# EasyEDA Pro project MatrixClock.eprj

# Schematic Schematic1
Board Name: 主控板; Create Date: 2025-03-18; Page Name: P1; Project Name: MatrixClock; Schematic Name: Schematic1; Update Date: 2025-03-29; Company: 小飞科技; Drawed: 程序匠小飞; Page Size: A4; Version: V1.0
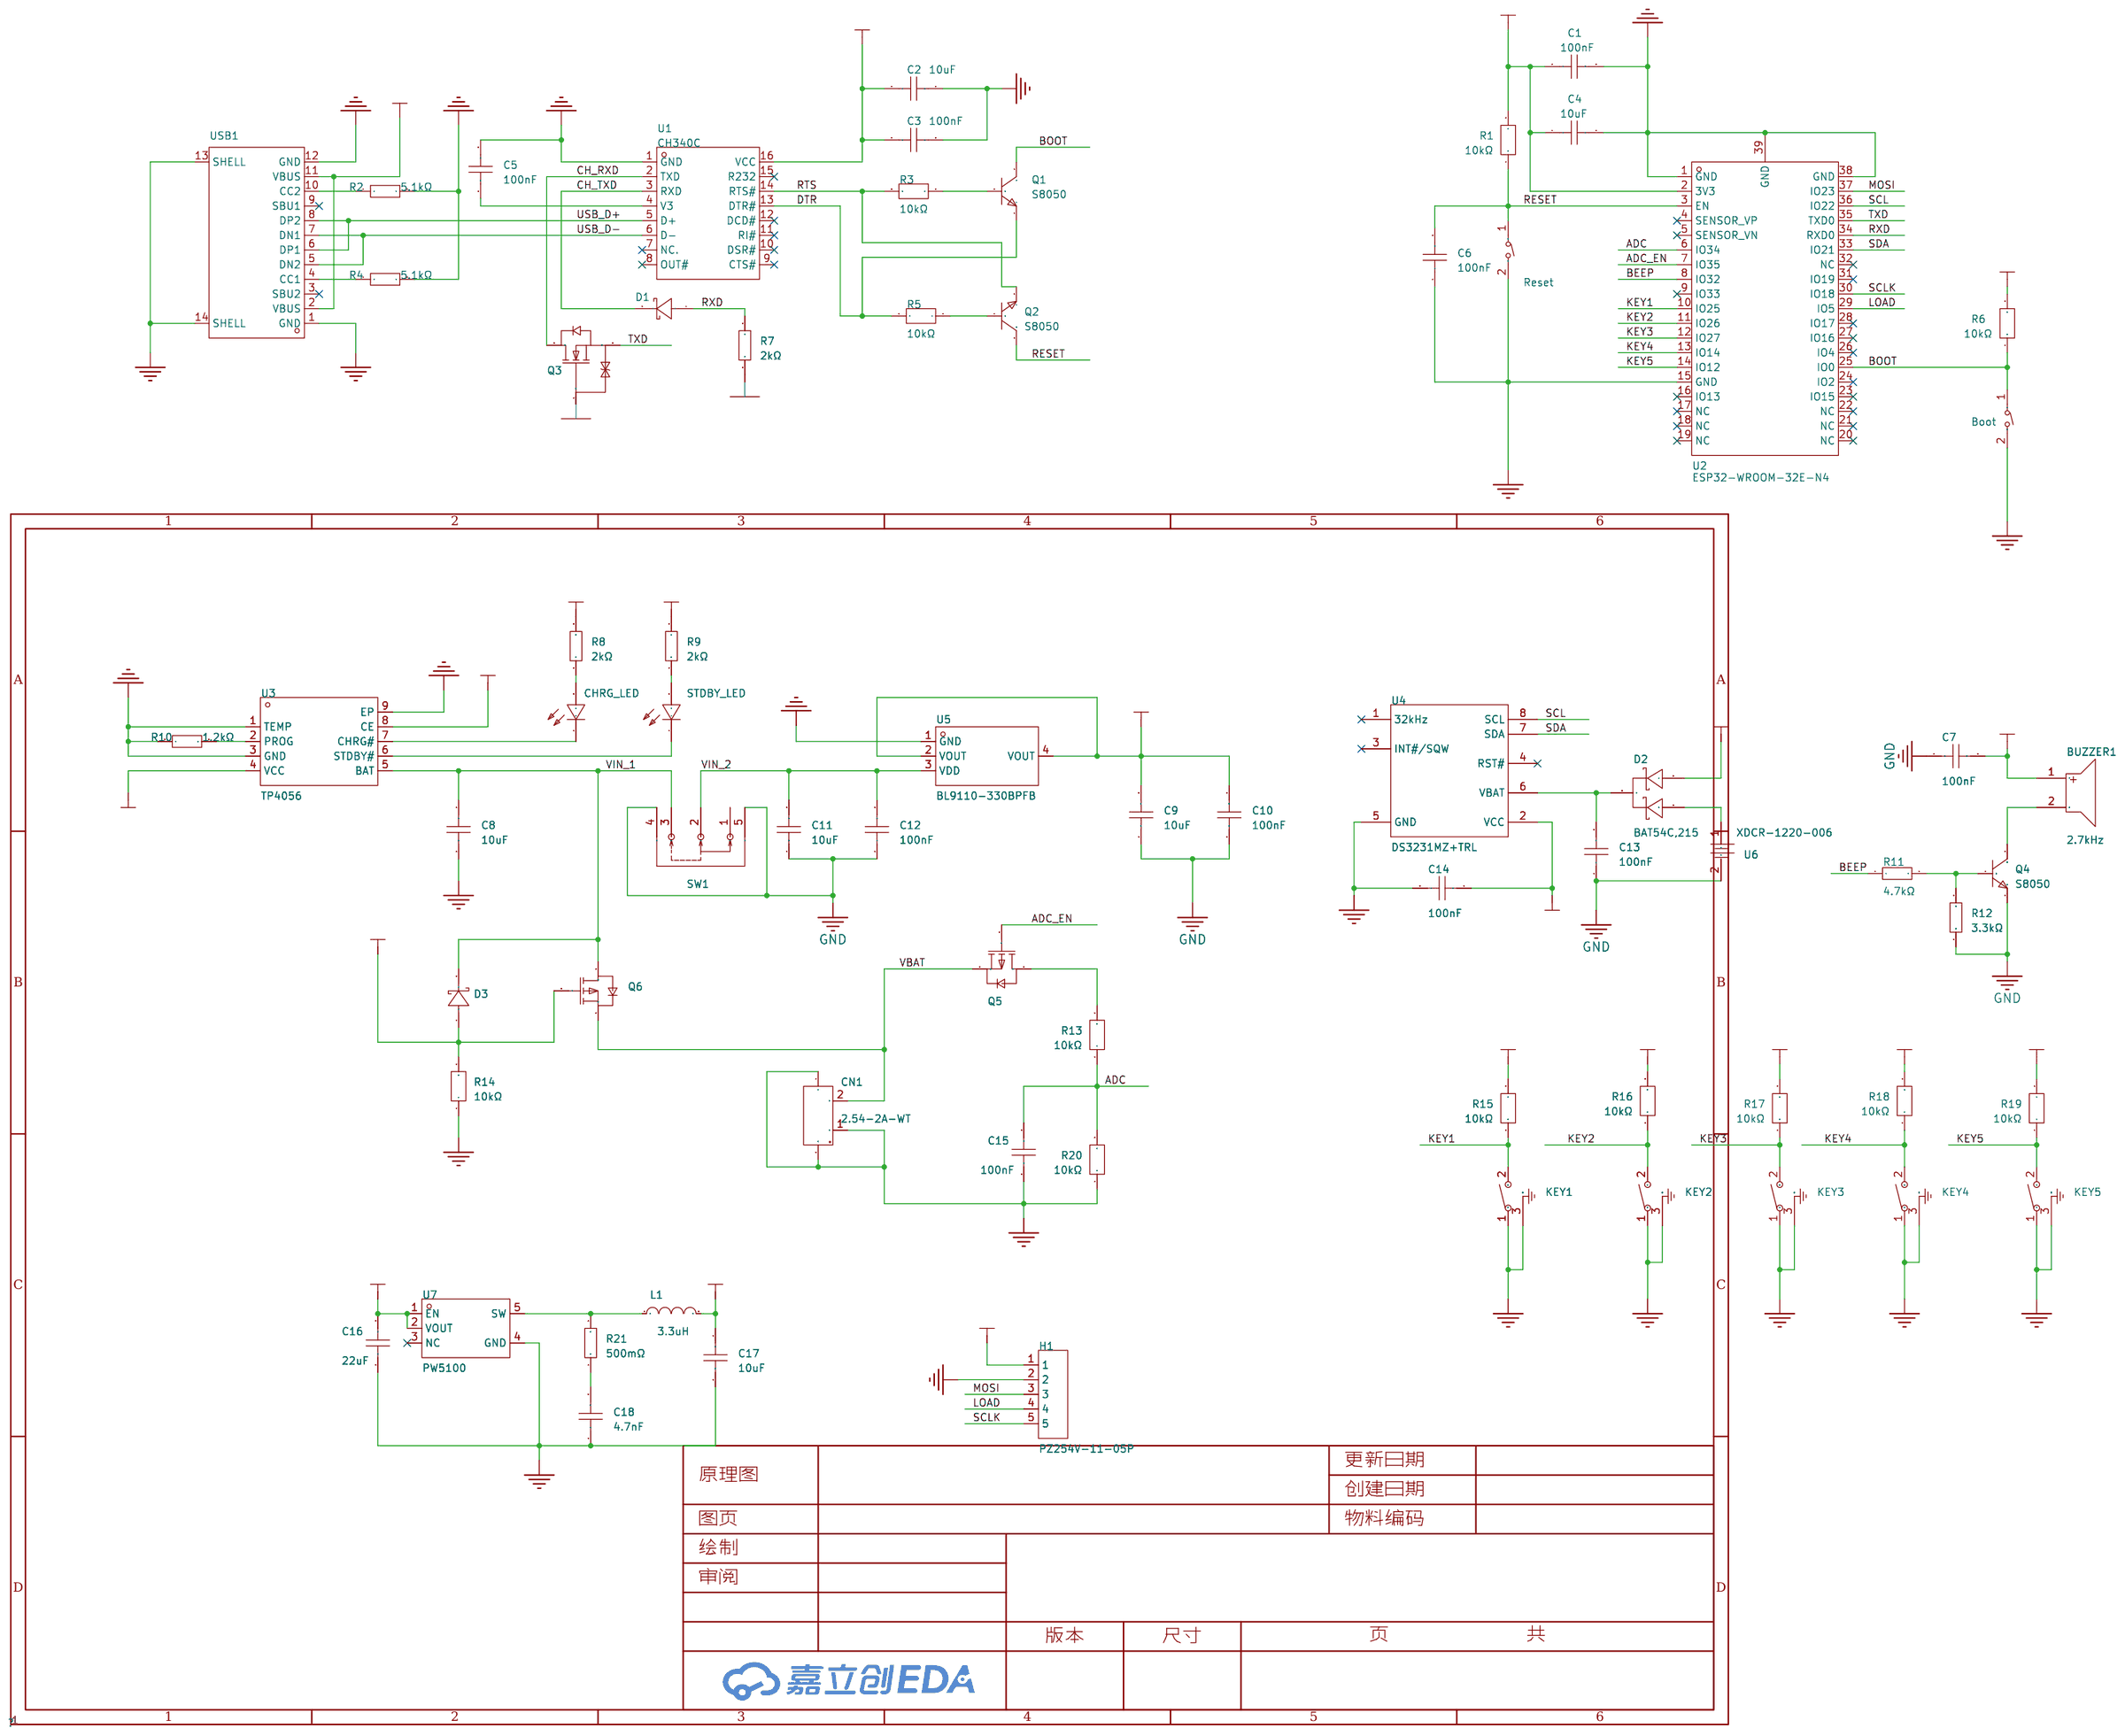
[diagram p0: schematic sheet]

## Parts
Boot  ZX-QC34-2TPDZ  [KEY-SMD_L3.9-W3.0-LS5.0-EH]
BUZZER1  2.7kHz  [BUZ-TH_BD9.0-P4.00-D0.6-FD]
C1  100nF  [C0603]
C2  10uF  [C0603]
C3  100nF  [C0603]
C4  10uF  [C0603]
C5  100nF  [C0603]
C6  100nF  [C0603]
C7  100nF  [C0603]
C8  10uF  [C0603]
C9  10uF  [C0603]
C10  100nF  [C0603]
C11  10uF  [C0603]
C12  100nF  [C0603]
C13  100nF  [C0603]
C14  100nF  [C0603]
C15  100nF  [C0603]
C16  22uF  [C0603]
C17  10uF  [C0603]
C18  4.7nF  [C0603]
CHRG_LED  NCD0603R1  [LED0603-RD_RED]
CN1  2.54-2A-WT  [CONN-SMD_2.54-2A-WT]
D1  B5819WS  [SOD-323_L1.7-W1.3-LS2.5-FD]
D2  BAT54C,215  [SOT-23-3_L2.9-W1.6-P1.90-LS2.8-BR]
D3  B5819WS  [SOD-323_L1.7-W1.3-LS2.5-FD]
H1  PZ254V-11-05P  [HDR-TH_5P-P2.54-V-M]
KEY1  TS-1045-A13B3-D2  [SW-SMD_L7.5-W8.0-P4.50_TS-1045-A13B3-D2]
KEY2  TS-1045-A13B3-D2  [SW-SMD_L7.5-W8.0-P4.50_TS-1045-A13B3-D2]
KEY3  TS-1045-A13B3-D2  [SW-SMD_L7.5-W8.0-P4.50_TS-1045-A13B3-D2]
KEY4  TS-1045-A13B3-D2  [SW-SMD_L7.5-W8.0-P4.50_TS-1045-A13B3-D2]
KEY5  TS-1045-A13B3-D2  [SW-SMD_L7.5-W8.0-P4.50_TS-1045-A13B3-D2]
L1  3.3uH  [IND-SMD_L4.4-W4.2-A]
Q1  S8050  [SOT-23-3_L2.9-W1.3-P1.90-LS2.3-BR]
Q2  S8050  [SOT-23-3_L2.9-W1.3-P1.90-LS2.3-BR]
Q3  2SK3018  [SOT-23-3_L2.9-W1.3-P1.90-LS2.4-BR]
Q4  S8050  [SOT-23-3_L2.9-W1.3-P1.90-LS2.3-BR]
Q5  SI2301CDS-T1-GE3-ES  [SOT-23-3_L2.9-W1.3-P1.90-LS2.4-BR]
Q6  SI2301CDS-T1-GE3-ES  [SOT-23-3_L2.9-W1.3-P1.90-LS2.4-BR]
R1  10kΩ  [R0603]
R2  5.1kΩ  [R0603]
R3  10kΩ  [R0603]
R4  5.1kΩ  [R0603]
R5  10kΩ  [R0603]
R6  10kΩ  [R0603]
R7  2kΩ  [R0603]
R8  2kΩ  [R0603]
R9  2kΩ  [R0603]
R10  1.2kΩ  [R0603]
R11  4.7kΩ  [R0603]
R12  3.3kΩ  [R0603]
R13  10kΩ  [R0603]
R14  10kΩ  [R0603]
R15  10kΩ  [R0603]
R16  10kΩ  [R0603]
R17  10kΩ  [R0603]
R18  10kΩ  [R0603]
R19  10kΩ  [R0603]
R20  10kΩ  [R0603]
R21  500mΩ  [R0603]
Reset  ZX-QC34-2TPDZ  [KEY-SMD_L3.9-W3.0-LS5.0-EH]
STDBY_LED  NCD0603C1  [LED0603-RD]
SW1  SK12D07VG4  [SW-TH_SK12D07VG4]
U1  CH340C  [SOP-16_L10.0-W3.9-P1.27-LS6.0-BL]
U2  ESP32-WROOM-32E-N4  [WIFI-SMD_ESP32-WROOM-32E]
U3  TP4056  [ESOP-8_L4.9-W3.9-P1.27-LS6.0-BL-EP]
U4  DS3231MZ+TRL  [SOIC-8_L4.9-W3.9-P1.27-LS6.0-BL]
U5  BL9110-330BPFB  [SOT-223_L6.5-W3.5-P2.30-LS7.0-BR]
U6  XDCR-1220-006  [BAT-SMD_CR1220-2ZX]
U7  PW5100  [SOT-23-5_L2.9-W1.6-P0.95-LS2.8-BL]
USB1  TYPE-C 16PIN 2MD(073)  [USB-C-SMD_TYPE-C-6PIN-2MD-073]

## Library data of the parts
Boot Reset = ZX-QC34-2TPDZ: 电路结构:单刀单掷;按钮形状:圆形按钮;作用力:2.6N;安装方式:立贴;开关长度:3mm;开关宽度:4mm;开关高度:2mm;带支架:不带;触点电流:50mA;额定电压(AC):250V;额定电压(DC):12V;绝缘电阻:100MΩ;机械寿命:10万次;; LCSC Part Name: 3*4*2贴片开关带柱; Supplier Part: C7470219; Manufacturer: Megastar(兆星); Supplier Footprint: SMD; JLCPCB Part Class: Extended Part; Datasheet: https://atta.szlcsc.com/upload/public/pdf/source/20230724/D2731FAADF93973E25928DE23F241F8A.pdf; Supplier: LCSC; Circuit: 单刀单掷; Actuator Style: 圆形按钮; Operating Force: 2.6N; Mounting Style: 立贴; Switch Length: 3mm; Switch Width: 4mm; Switch Height: 2mm; Strike Gundam: 不带; Contact Current: 50mA; Voltage Rating (AC): 250V; Voltage Rating (DC): 12V; Insulation Resistance: 100MΩ; Actuator/Cap Color: 黑色; Pin Style: 鸥翼型; Mechanical Life: 10万次; Operating Temperature: -30℃~+80℃
BUZZER1 = QMB-09B-03: LCSC Part Name: 无源蜂鸣器QMB-09B-03; Supplier Part: C96256; Manufacturer: 华能; Supplier Footprint: 插件,D=9mm; JLCPCB Part Class: 扩展库; Datasheet: https://atta.szlcsc.com/upload/public/pdf/source/20210401/C96256_958B17753B5AD7CBFBCFFC7C095B4484.pdf; Supplier: LCSC; Driver Circuitry: 无源(外部驱动); Technology: 电磁式; Voltage - Supply: 2V~5V; Sound Pressure Level(SPL): 85dB; Diameter(φD): 9mm; Height: 5.7mm
C1 C3 C5-C7 C10 C12-C15 = CC0603KRX7R9BB104: 容值:100nF;精度:±10%;额定电压:50V;材质(温度系数):X7R;; LCSC Part Name: 100nF ±10% 50V; Supplier Part: C14663; Manufacturer: YAGEO(国巨); Supplier Footprint: 0603; JLCPCB Part Class: 基础库; Datasheet: https://atta.szlcsc.com/upload/public/pdf/source/20180910/C282072_33301C7F631E79921B82A8DAC6BCC5B3.pdf; Supplier: LCSC; Tolerance: ±10%; Voltage Rated: 50V; Temperature Coefficient: X7R
C2 C4 C8 C9 C11 C17 = CL10A106MA8NRNC: 容值:10uF;精度:±20%;额定电压:25V;材质(温度系数):X5R;; LCSC Part Name: 10uF ±20% 25V; Supplier Part: C96446; Manufacturer: SAMSUNG(三星); Supplier Footprint: 0603; JLCPCB Part Class: 基础库; Datasheet: https://atta.szlcsc.com/upload/public/pdf/source/20160218/1457707763339.pdf; Supplier: LCSC; Tolerance: ±20%; Voltage Rated: 25V; Temperature Coefficient: X5R
C16 = CGA0603X5R226M160JT: 容值:22uF;精度:±20%;额定电压:16V;材质(温度系数):X5R;; LCSC Part Name: 22uF ±20% 16V; Supplier Part: C6119868; Manufacturer: HRE(芯声); Supplier Footprint: 0603; JLCPCB Part Class: Extended Part; Supplier: LCSC; Tolerance: ±20%; Voltage Rated: 16V; Temperature Coefficient: X5R
C18 = CGA0603X7R472K500JT: 容值:4.7nF;精度:±10%;额定电压:50V;材质(温度系数):X7R;; LCSC Part Name: 4.7nF ±10% 50V; Supplier Part: C7503499; Manufacturer: HRE(芯声); Supplier Footprint: 0603; JLCPCB Part Class: 扩展库; Supplier: LCSC; Tolerance: ±10%; Voltage Rated: 50V; Temperature Coefficient: X7R
CHRG_LED = NCD0603R1_C84263: 灯头类型:-;发光颜色:红色;正向电压(VF):1.6V~2.6V;功率:65mW;正向电流:20mA;主波长:615nm~630nm;二极管配置:独立二极管;透镜颜色:无色透明透镜;色温:-;发光强度:80mcd~220mcd;发光角度:130°;载带方式:-;工作温度:-30℃~+85℃;; Supplier Part: C84263; Manufacturer: 国星光电; Supplier Footprint: 0603; JLCPCB Part Class: 扩展库; Datasheet: https://atta.szlcsc.com/upload/public/pdf/source/20200820/C84263_DABC6A75E58F576973B407FDBA283D60.pdf; Supplier: LCSC; Emitted Color: 红色; Forward Voltage (VF): 1.6V~2.6V; Power Dissipation: 65mW; Forward Current: 20mA; Dominant Wavelength: 615nm~630nm; Diode Configuration: 独立二极管; Lens Color: 无色透明透镜; Luminous Intensity: 80mcd~220mcd; Viewing Angle: 130°; Operating Temperature: -30℃~+85℃
CN1 = 2.54-2A-WT: 插针结构:1x2P;间距:2.54mm;安装方式:卧贴;参考系列:XH;总PIN数:2P;排数:1;每排PIN数:2;行距:-;额定电流:500mA;工作温度范围:-25℃~+85℃;; LCSC Part Name: 1x2P 间距:2.54mm 卧贴 系列:XH; Supplier Part: C722696; Manufacturer: CAX(创都); Supplier Footprint: SMD,P=2.54mm,卧贴; JLCPCB Part Class: 扩展库; Datasheet: https://atta.szlcsc.com/upload/public/pdf/source/20200831/C722696_77A3476FAF7CFEE79ECA533977340414.pdf; Supplier: LCSC; Pins Structure: 1x2P; Pitch: 2.54mm; Mounting Style: 卧贴; Reference Series: XH; Number of Pins: 2P; Number of Rows: 1; Number of PINs Per Row: 2; Current Rating (Max): 500mA; Operating Temperature Range: -25℃~+85℃
D1 D3 = B5819WS_C7420331: 二极管配置:独立式;正向压降(Vf):600mV@1.0A;直流反向耐压(Vr):40V;平均整流电流(Io):1A;; LCSC Part Name: 电压:40V 电流:1A; Supplier Part: C7420331; Manufacturer: 宏迦橙; Supplier Footprint: SOD-323; JLCPCB Part Class: 扩展库; Datasheet: https://atta.szlcsc.com/upload/public/pdf/source/20230828/03CA0F4F90DAE368A7153B7B5E4D0651.pdf; Supplier: LCSC; Diode Configuration: 独立式; Forward Voltage (Vf@If): 600mV@1.0A; Reverse Voltage (Vr): 40V; Average Rectified Current (Io): 1A; Reverse Leakage Current (Ir): 1mA@40V; Peak forward surge current: 10A
D2 = BAT54C,215: LCSC Part Name: 电压:30V 电流:200mA; Supplier Part: C37704; Manufacturer: Nexperia(安世); Supplier Footprint: SOT-23; JLCPCB Part Class: 扩展库; Datasheet: https://atta.szlcsc.com/upload/public/pdf/source/20240724/0FA4CD208E70EC919F34217EC6E42B23.pdf; Supplier: LCSC; Diode Configuration: 1对共阴极; Forward Voltage (Vf@If): 800mV@100mA; Reverse Voltage (Vr): 30V; Rectified Current: 200mA; Reverse Leakage Current (Ir): 2uA@25V
H1 = PZ254V-11-05P: LCSC Part Name: 1x5P 间距:2.54mm 方针 直插; Supplier Part: C492404; Manufacturer: XFCN(兴飞); Supplier Footprint: 插件,P=2.54mm; JLCPCB Part Class: 扩展库; Datasheet: https://atta.szlcsc.com/upload/public/pdf/source/20200309/C492404_E51533260F8710EFF5D4617281164C1D.pdf; Supplier: LCSC; Pin Structure: 1x5P; Pitch: 2.54mm; Circluar Pins/Square Pins: 方针; Mounting Type: 直插; Number of Rows: 单排; Number of Pins: 5P; Length of Mating Pin: 6mm; Insulation Height: 2.5mm; Length of End Connection Pin: 3mm; Contact Material: 黄铜; Operating Temperature: -40℃~+105℃; Color: 黑色
KEY1-KEY5 = TS-1045-A13B3-D2: 电路结构:单刀单掷;按钮形状:圆形按钮;作用力:250gf;安装方式:卧贴;开关高度:10mm;带支架:带支架;机械寿命:-;; LCSC Part Name: 轻触开关6*6*10带支架贴片支架侧按按键250gf; Supplier Part: C557898; Manufacturer: Yuandi(元迪); Supplier Footprint: SMD; JLCPCB Part Class: 扩展库; Datasheet: https://atta.szlcsc.com/upload/public/pdf/source/20200522/C557886_6DF50336386BA259B6638E5ADB1DAB20.pdf; Supplier: LCSC; Circuit: 单刀单掷; Actuator Style: 圆形按钮; Operating Force: 250gf; Mounting Style: 卧贴; Switch Height: 10mm; Strike Gundam: 带支架; Actuator/Cap Color: 黑色; Pin Style: SMD接片
L1 = FXL0420-3R3-M: 电感值:3.3uH;精度:±20%;额定电流:3.3A;饱和电流(Isat):4A;类型:一体成型电感;; LCSC Part Name: 3.3uH ±20% 4A; Supplier Part: C167207; Manufacturer: cjiang(长江微电); Supplier Footprint: SMD,4.2x4.4mm; JLCPCB Part Class: Extended Part; Datasheet: https://atta.szlcsc.com/upload/public/pdf/source/20230516/FBADA9890E7FBE97C620F1D8B562D733.pdf; Supplier: LCSC; Tolerance: ±20%; Rated Current: 3.3A; Saturation Current (Isat): 4A; DC Resistance (DCR): 87mΩ; Type: 一体成型电感
Q1 Q2 Q4 = S8050_C20069125: 晶体管类型:NPN;集电极电流(Ic):500mA;集射极击穿电压(Vceo):25V;功率(Pd):300mW;直流电流增益(hFE@Ic,Vce):120@50mA,1.0V;; LCSC Part Name: NPN 电流:500mA 耐压:25V; Supplier Part: C20069125; Manufacturer: 宏迦橙; Supplier Footprint: SOT-23; JLCPCB Part Class: 扩展库; Datasheet: https://atta.szlcsc.com/upload/public/pdf/source/20240403/2D78449C96B6E27F13BF8BDF79E27159.pdf; Supplier: LCSC; Transistor Type: NPN; Collector Current (Ic): 500mA; Collector-Emitter Breakdown Voltage (Vceo): 25V; Power Dissipation (Pd): 300mW; DC Current Gain (hFE@Ic,Vce): 120@50mA,1.0V; Transition Frequency (fT): 100MHz; Collector Cut-Off Current (Icbo): 100nA; Collector-Emitter Saturation Voltage (VCE(sat)@Ic,Ib): 600mV@500mA,50mA; Operating Temperature: -55℃~+150℃
Q3 = 2SK3018_C8562: LCSC Part Name: 1个N沟道 耐压:30V 电流:100mA; Supplier Part: C8562; Manufacturer: CJ(江苏长电/长晶); Supplier Footprint: SOT-23; JLCPCB Part Class: 扩展库; Datasheet: https://atta.szlcsc.com/upload/public/pdf/source/20140809/1457707215233.pdf; Supplier: LCSC; Type: 1个N沟道; Drain to Source Voltage: 30V; Current - Continuous Drain(Id): 100mA; RDS(on): 13Ω@2.5V,1mA; Pd - Power Dissipation: 350mW; Gate Threshold Voltage (Vgs(th)@Id): 800mV; Input Capacitance(Ciss@Vds): 13pF; Reverse Transfer Capacitance (Crss@Vds): 4pF; Operating Temperature: -55℃~+150℃
Q5 Q6 = SI2301CDS-T1-GE3-ES: 类型:1个P沟道;漏源电压(Vdss):20V;连续漏极电流(Id):3A;功率(Pd):1W;导通电阻(RDS(on)@Vgs,Id):58mΩ@4.5V,3A;阈值电压(Vgs(th)@Id):700mV@250uA;; LCSC Part Name: 1个P沟道 耐压:20V 电流:3A; Supplier Part: C5224168; Manufacturer: ElecSuper(静芯微); Supplier Footprint: SOT-23; JLCPCB Part Class: 扩展库; Datasheet: https://atta.szlcsc.com/upload/public/pdf/source/20221027/42CFC3ED47648D38F0E217DE38FA5A17.pdf; Supplier: LCSC; Type: 1个P沟道; Drain Source Voltage (Vdss): 20V; Continuous Drain Current (Id): 3A; Power Dissipation (Pd): 1W; Drain Source On Resistance (RDS(on)@Vgs,Id): 58mΩ@4.5V,3A; Gate Threshold Voltage (Vgs(th)@Id): 700mV@250uA; Total Gate Charge (Qg@Vgs): 3.3nC; Input Capacitance (Ciss@Vds): 405pF; Reverse Transfer Capacitance (Crss@Vds): 55pF
R1 R3 R5 R6 R13-R20 = AC0603FR-0710KL: 电阻类型:厚膜电阻;阻值:10kΩ;精度:±1%;功率:100mW;最大工作电压:75V;温度系数:±100ppm/℃;; LCSC Part Name: 厚膜电阻 10kΩ ±1% 100mW; Supplier Part: C116677; Manufacturer: YAGEO(国巨); Supplier Footprint: 0603; JLCPCB Part Class: Extended Part; Datasheet: https://atta.szlcsc.com/upload/public/pdf/source/20180927/C229861_4ABDC471507C1ED6AFB4BA66AFC8620A.pdf; Supplier: LCSC; Type: 厚膜电阻; Tolerance: ±1%; Power(Watts): 100mW; Overload Voltage (Max): 75V; Temperature Coefficient: ±100ppm/℃; Operating Temperature Range: -55℃~+155℃
R2 R4 = FRC0603F5101TS: 电阻类型:厚膜电阻;阻值:5.1kΩ;精度:±1%;功率:100mW;最大工作电压:75V;温度系数:±100ppm/℃;; LCSC Part Name: 5.1kΩ ±1% 100mW 厚膜电阻; Supplier Part: C2907044; Manufacturer: FOJAN(富捷); Supplier Footprint: 0603; JLCPCB Part Class: Extended Part; Datasheet: https://atta.szlcsc.com/upload/public/pdf/source/20211221/925EC7D7225764EE0046F22065062C87.pdf; Supplier: LCSC; Type: 厚膜电阻; Tolerance: ±1%; Power(Watts): 100mW; Overload Voltage (Max): 75V; Temperature Coefficient: ±100ppm/℃; Operating Temperature Range: -55℃~+155℃
R7-R9 = 0603WAF2001T5E: 电阻类型:厚膜电阻;阻值:2kΩ;精度:±1%;功率:100mW;最大工作电压:75V;温度系数:±100ppm/℃;; LCSC Part Name: 2kΩ ±1% 100mW 厚膜电阻; Supplier Part: C22975; Manufacturer: UNI-ROYAL(厚声); Supplier Footprint: 0603; JLCPCB Part Class: Basic Part; Datasheet: https://atta.szlcsc.com/upload/public/pdf/source/20200306/C422600_1E6D84923E4A46A82E41ADD87F860B5C.pdf; Supplier: LCSC; Type: 厚膜电阻; Tolerance: ±1%; Power(Watts): 100mW; Overload Voltage (Max): 75V; Temperature Coefficient: ±100ppm/℃; Operating Temperature Range: -55℃~+155℃
R10 = 0603WAF1201T5E: 电阻类型:厚膜电阻;阻值:1.2kΩ;精度:±1%;功率:100mW;最大工作电压:75V;温度系数:±100ppm/℃;; LCSC Part Name: 1.2kΩ ±1% 100mW 厚膜电阻; Supplier Part: C22765; Manufacturer: UNI-ROYAL(厚声); Supplier Footprint: 0603; JLCPCB Part Class: 基础库; Datasheet: https://atta.szlcsc.com/upload/public/pdf/source/20200306/C422600_1E6D84923E4A46A82E41ADD87F860B5C.pdf; Supplier: LCSC; Type: 厚膜电阻; Tolerance: ±1%; Power(Watts): 100mW; Overload Voltage (Max): 75V; Temperature Coefficient: ±100ppm/℃; Operating Temperature Range: -55℃~+155℃
R11 = RC0603FR-074K7L: LCSC Part Name: 厚膜电阻 4.7kΩ ±1% 100mW; Supplier Part: C99782; Manufacturer: YAGEO(国巨); Supplier Footprint: 0603; JLCPCB Part Class: 扩展库; Datasheet: https://atta.szlcsc.com/upload/public/pdf/source/20180224/C181757_15194369480721363983.pdf; Supplier: LCSC; Type: 厚膜电阻; Tolerance: ±1%; Power(Watts): 100mW; Overload Voltage (Max): 75V; Temperature Coefficient: ±100ppm/℃; Operating Temperature Range: -55℃~+155℃
R12 = RC0603FR-073K3L: LCSC Part Name: 厚膜电阻 3.3kΩ ±1% 100mW; Supplier Part: C108078; Manufacturer: YAGEO(国巨); Supplier Footprint: 0603; JLCPCB Part Class: 扩展库; Datasheet: https://atta.szlcsc.com/upload/public/pdf/source/20180821/C275644_0D56F95EFF785E7D9A1FEF436B37DA78.pdf; Supplier: LCSC; Type: 厚膜电阻; Tolerance: ±1%; Power(Watts): 100mW; Overload Voltage (Max): 75V; Temperature Coefficient: ±100ppm/℃; Operating Temperature Range: -55℃~+155℃
R21 = 0603WAF500LT5E: 电阻类型:厚膜电阻;阻值:500mΩ;精度:±1%;功率:100mW;最大工作电压:75V;温度系数:±800ppm/℃;; LCSC Part Name: 500mΩ ±1% 100mW 厚膜电阻; Supplier Part: C45312; Manufacturer: UNI-ROYAL(厚声); Supplier Footprint: 0603; JLCPCB Part Class: 扩展库; Datasheet: https://atta.szlcsc.com/upload/public/pdf/source/20200306/C422600_1E6D84923E4A46A82E41ADD87F860B5C.pdf; Supplier: LCSC; Type: 厚膜电阻; Tolerance: ±1%; Power(Watts): 100mW; Overload Voltage (Max): 75V; Temperature Coefficient: ±800ppm/℃; Operating Temperature Range: -55℃~+155℃
STDBY_LED = NCD0603C1: Supplier Part: C84264; Manufacturer: 国星光电; Supplier Footprint: 0603; JLCPCB Part Class: 扩展库; Datasheet: https://atta.szlcsc.com/upload/public/pdf/source/20200820/C84264_94B2FEF0C4ADFC9200EBC3AD62A401B4.pdf; Supplier: LCSC; Emitted Color: 黄绿色; Forward Voltage (VF): 1.6V~2.6V; Power Dissipation: 65mW; Forward Current: 5mA; Dominant Wavelength: 565nm~578nm; Lens Color: 无色透明透镜; Luminous Intensity: 5mcd~13mcd; Viewing Angle: 140°; Operating Temperature: -30℃~+85℃
SW1 = SK12D07VG4: LCSC Part Name: 3脚2档位 卧插 滑动开关; Supplier Part: C393937; Manufacturer: SHOU HAN(首韩); Supplier Footprint: 插件; JLCPCB Part Class: 扩展库; Datasheet: https://atta.szlcsc.com/upload/public/pdf/source/20190521/C393937_939FE26E571CC67D2D532E953108A1B0.pdf; Supplier: LCSC; Circuit: 单刀双掷; Actuator Style: 矩形柱状; Pin Style: PC引脚; Switch Height: 8.8mm; Current Rating (DC): 500mA; Voltage Rating (DC): 50V; Mechanical Life: 5千次
U1 = CH340C: 应用功能:收发器;接口协议:USB 2.0;数据速率:2Mbps;; LCSC Part Name: CH340C USB转串口芯片 CH340; Supplier Part: C84681; Manufacturer: WCH(南京沁恒); Supplier Footprint: SOP-16; JLCPCB Part Class: 扩展库; Datasheet: https://atta.szlcsc.com/upload/public/pdf/source/20200819/C84681_ADBED554CE321879DBD6B1D06488689C.pdf; Supplier: LCSC; Applications Function: 收发器; Protocol: USB 2.0; Supply Voltage: 3.3V；5V; Data Rate: 2Mbps
U2 = ESP32-WROOM-32E-N4: ESP32-WROOM-32E 集成 ESP32-D0WD-V3 芯片，具有高的稳定性和安全性能。; LCSC Part Name: 通用型Wi-Fi+BT+BLE MCU模组; Supplier Part: C701341; Manufacturer: ESPRESSIF(乐鑫); Supplier Footprint: SMD,18x25.5mm; JLCPCB Part Class: 扩展库; Datasheet: https://atta.szlcsc.com/upload/public/pdf/source/20220601/0020821B65DE5740BBACA5FACC5CF3B6.pdf; Supplier: LCSC
U3 = TP4056_C725790: Supplier Part: C725790; Manufacturer: UMW(友台半导体); Supplier Footprint: ESOP-8; JLCPCB Part Class: 扩展库; Datasheet: https://atta.szlcsc.com/upload/public/pdf/source/20231109/CF74897CE79A500F7FE27A45ADCCC631.pdf; Supplier: LCSC
U4 = DS3231MZ+TRL: LCSC Part Name: 高精度RTC集成MEMS谐振器; Supplier Part: C107410; Manufacturer: ADI(亚德诺)/MAXIM(美信); Supplier Footprint: SOIC-8; JLCPCB Part Class: 扩展库; Datasheet: https://atta.szlcsc.com/upload/public/pdf/source/20170620/1497944726830.pdf; Supplier: LCSC; Interface: I2C; Operating Voltage: 2.3V~5.5V; Operating Temperature: -40℃~+85℃
U5 = BL9110-330BPFB: 输出类型:固定;输出极性:正;输出通道数:1;最大输入电压:6V;输出电压:3.3V;压差:390mV@(1A);输出电流:1A;电源纹波抑制比(PRSS):70dB@(1kHz);; LCSC Part Name: Vin=6V Vout=3.3V 1A 70dB@(1kHz); Supplier Part: C169246; Manufacturer: BL(上海贝岭); Supplier Footprint: SOT-223; JLCPCB Part Class: 扩展库; Datasheet: https://atta.szlcsc.com/upload/public/pdf/source/20180104/C169246_15150688220401230505.pdf; Supplier: LCSC; Output Type: 固定; Output Polarity: 正; Number of Outputs: 1; Maximum Input Voltage: 6V; Output Voltage: 3.3V; Dropout Voltage: 390mV@(1A); Output Current: 1A; Power Supply Rejection Ratio (PRSS): 70dB@(1kHz)
U6 = XDCR-1220-006: LCSC Part Name: 电池底座 适用电池:CR1220; Supplier Part: C7498147; Manufacturer: LX(连欣科技); Supplier Footprint: SMD; JLCPCB Part Class: 扩展库; Datasheet: https://atta.szlcsc.com/upload/public/pdf/source/20230925/F169C68BCD9C1D37704E8697A39B6B0C.pdf; Supplier: LCSC; Connector Type: 电池底座; Battery Type: CR1220; Contact Plating: 金; Operating Temperature Range: -40℃~+85℃
U7 = PW5100: Supplier Part: C9900000624; Supplier Footprint: SOT-23-5; JLCPCB Part Class: 扩展库; Supplier: LCSC
USB1 = TYPE-C 16PIN 2MD(073): 连接器类型:Type-C;标准:-;公母:母;端口数量:1;触点数量:16P;安装方式:卧贴;额定电流 - 电源:5A;工作温度范围:-25℃~+85℃;; LCSC Part Name: Type-C 母 卧贴; Supplier Part: C2765186; Manufacturer: SHOU HAN(首韩); Supplier Footprint: SMD; JLCPCB Part Class: 扩展库; Datasheet: https://atta.szlcsc.com/upload/public/pdf/source/20211123/39B17C16241EAC15C5E277BDA434118E.pdf; Supplier: LCSC; Connector Type: Type-C; Gender: 母; Number of Ports: 1; Number of Contacts: 16P; Mounting Style: 卧贴; Current Rating - Power (Max): 5A; Operating Temperature Range: -25℃~+85℃

## Nets
3V3: BUZZER1.1 C1.1 C4.1 C7.2 C9.2 C10.2 C14.1 D2.2(A) Q3.1(G) R1.2 R6.2 R7.2 R15.2 R16.2 R17.2 R18.2 R19.2 U2.2(3V3) U4.2(VCC) U5.2(VOUT) U5.4(VOUT)
5V: C16.2 H1.1 U7.1(EN) U7.2(VOUT)
GND: Boot.2 C1.2 C2.2 C3.2 C4.2 C5.2 C6.1 C7.1 C8.2 C9.1 C10.1 C11.1 C12.1 C13.1 C14.2 C15.1 C16.1 C17.2 C18.1 CN1.1 CN1.3 CN1.4 H1.2 KEY1.1 KEY1.3(GND) KEY2.1 KEY2.3(GND) KEY3.1 KEY3.3(GND) KEY4.1 KEY4.3(GND) KEY5.1 KEY5.3(GND) Q4.2(E) R2.2 R4.2 R10.1 R12.1 R14.1 R20.1 Reset.2 SW1.4 SW1.5 U1.1(GND) U2.1(GND) U2.15(GND) U2.38(GND) U2.39(GND) U3.1(TEMP) U3.3(GND) U3.9(EP) U4.5(GND) U5.1(GND) U6.2 U7.4(GND) USB1.1(GND) USB1.12(GND) USB1.13(SHELL) USB1.14(SHELL)
VBAT: CN1.2 Q5.2(S) Q6.2(S)
VBUS: C2.1 C3.1 D3.1(A) Q6.1(G) R8.2 R9.2 R14.2 U1.16(VCC) U3.4(VCC) U3.8(CE) USB1.2(VBUS) USB1.11(VBUS)
VIN_1: C8.1 D3.2(K) Q6.3(D) SW1.3 U3.5(BAT)
VIN_2: C11.2 C12.2 C17.1 L1.2 SW1.2 U5.3(VDD)
ADC: C15.2 R13.1 R20.2 U2.6(IO34)
ADC_EN: Q5.1(G) U2.7(IO35)
BEEP: R11.1 U2.8(IO32)
BOOT: Boot.1 Q1.3(C) R6.1 U2.25(IO0)
CH_RXD: Q3.3(D) U1.2(TXD)
CH_TXD: D1.2(K) U1.3(RXD)
DTR: Q1.2(E) R5.2 U1.13(DTR#)
KEY1: KEY1.2 R15.1 U2.10(IO25)
KEY2: KEY2.2 R16.1 U2.11(IO26)
KEY3: KEY3.2 R17.1 U2.12(IO27)
KEY4: KEY4.2 R18.1 U2.13(IO14)
KEY5: KEY5.2 R19.1 U2.14(IO12)
LOAD: H1.4 U2.29(IO5)
MOSI: H1.3 U2.37(IO23)
RESET: C6.2 Q2.3(C) R1.1 Reset.1 U2.3(EN)
RTS: Q2.2(E) R3.2 U1.14(RTS#)
RXD: D1.1(A) R7.1 U2.34(RXD0)
SCL: U2.36(IO22) U4.8(SCL)
SCLK: H1.5 U2.30(IO18)
SDA: U2.33(IO21) U4.7(SDA)
TXD: Q3.2(S) U2.35(TXD0)
USB_D+: U1.5(D+) USB1.6(DP1) USB1.8(DP2)
USB_D-: U1.6(D-) USB1.5(DN2) USB1.7(DN1)
$1N1245: Q2.1(B) R5.1
$1N2308: R10.2 U3.2(PROG)
$1N2312: CHRG_LED.2(A) R8.1
$1N2313: R9.1 STDBY_LED.2(+)
$1N2314: CHRG_LED.1(K) U3.7(CHRG#)
$1N2315: STDBY_LED.1(-) U3.6(STDBY#)
$1N7195: C13.2 D2.3(K) U4.6(VBAT)
$1N7301: D2.1(A) U6.1
$1N7868: C5.1 U1.4(V3)
$1N8103: R4.1 USB1.4(CC1)
$1N8104: R2.1 USB1.10(CC2)
$1N8623: Q5.3(D) R13.2
$1N8862: BUZZER1.2 Q4.3(C)
$1N8910: Q4.1(B) R11.2 R12.2
$1N9319: C18.2 R21.1
$1N9320: L1.1 R21.2 U7.5(SW)
$1N16703: Q1.1(B) R3.1

Not connected (* = marked no-connect by the designer): SW1 1; U1 7(NC.)* 8(OUT#)* 9(CTS#)* 10(DSR#)* 11(RI#)* 12(DCD#)* 15(R232)*; U2 4(SENSOR_VP)* 5(SENSOR_VN)* 9(IO33)* 16(IO13)* 17(NC)* 18(NC)* 19(NC)* 20(NC)* 21(NC)* 22(NC)* 23(IO15)* 24(IO2)* 26(IO4)* 27(IO16)* 28(IO17)* 31(IO19)* 32(NC)*; U4 1(32kHz)* 3(INT#/SQW)* 4(RST#)*; U7 3(NC)*; USB1 3(SBU2)* 9(SBU1)*

# Board PCB1
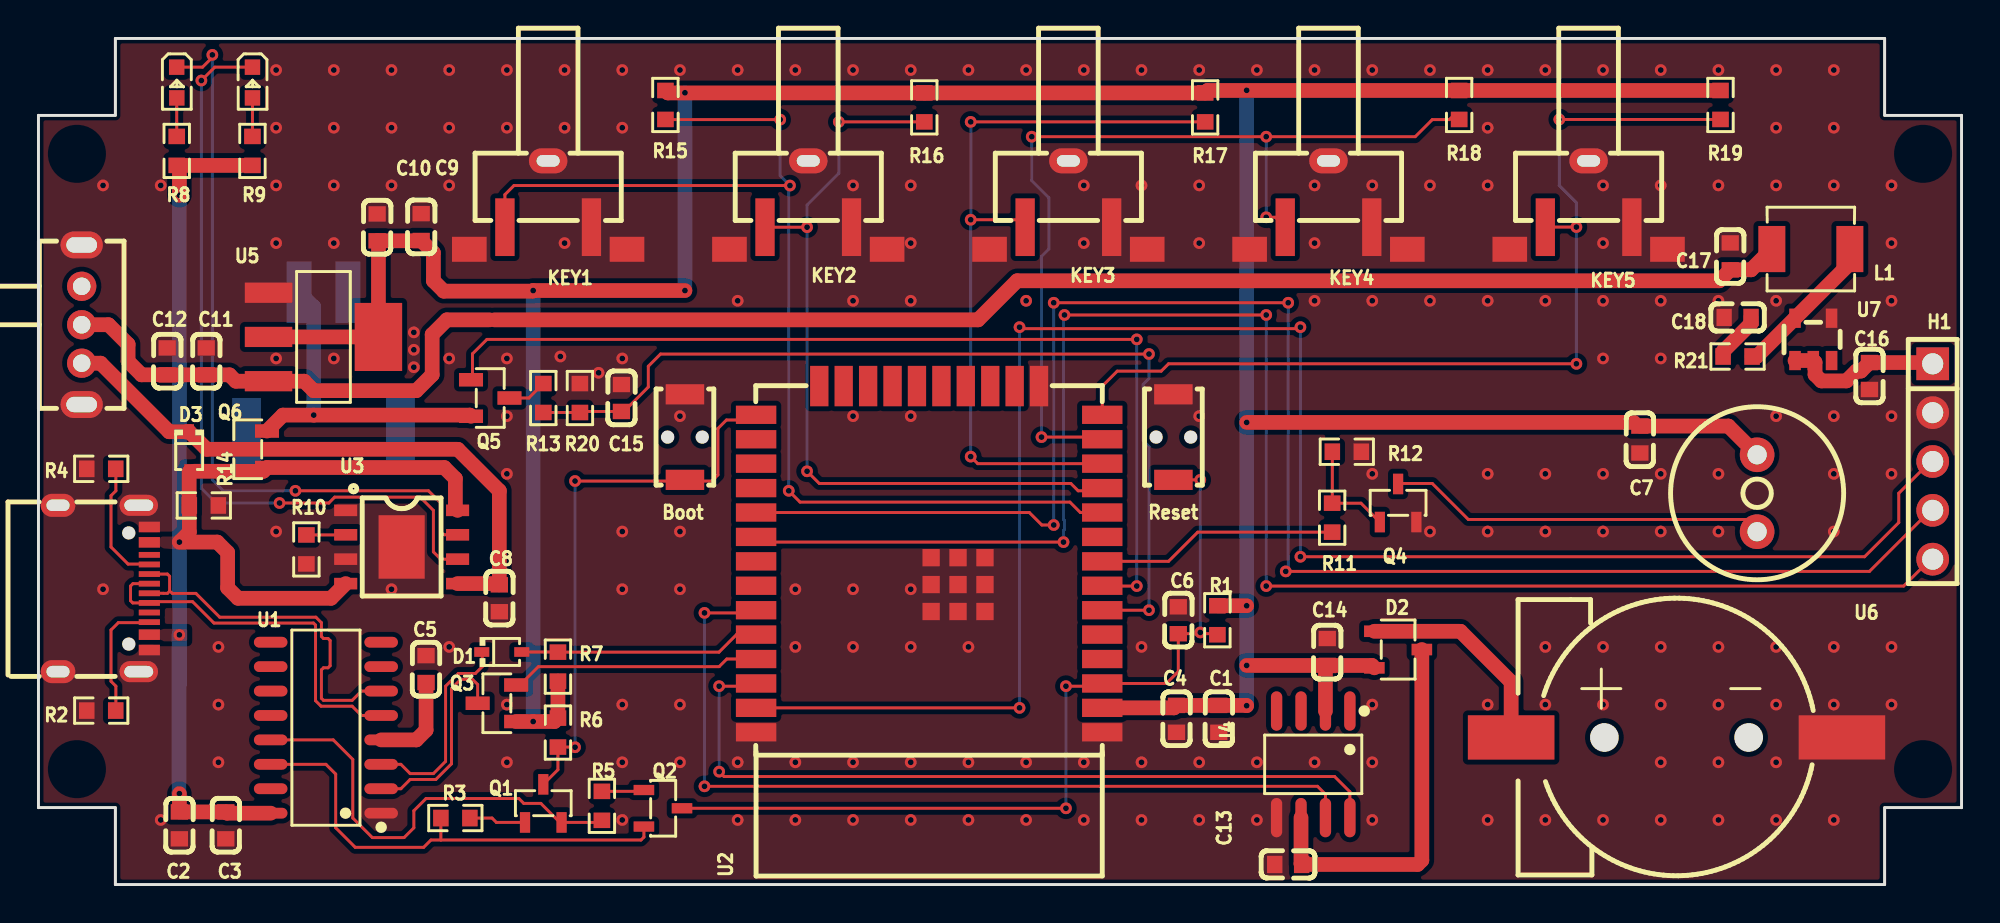
[diagram p1: board, top side]
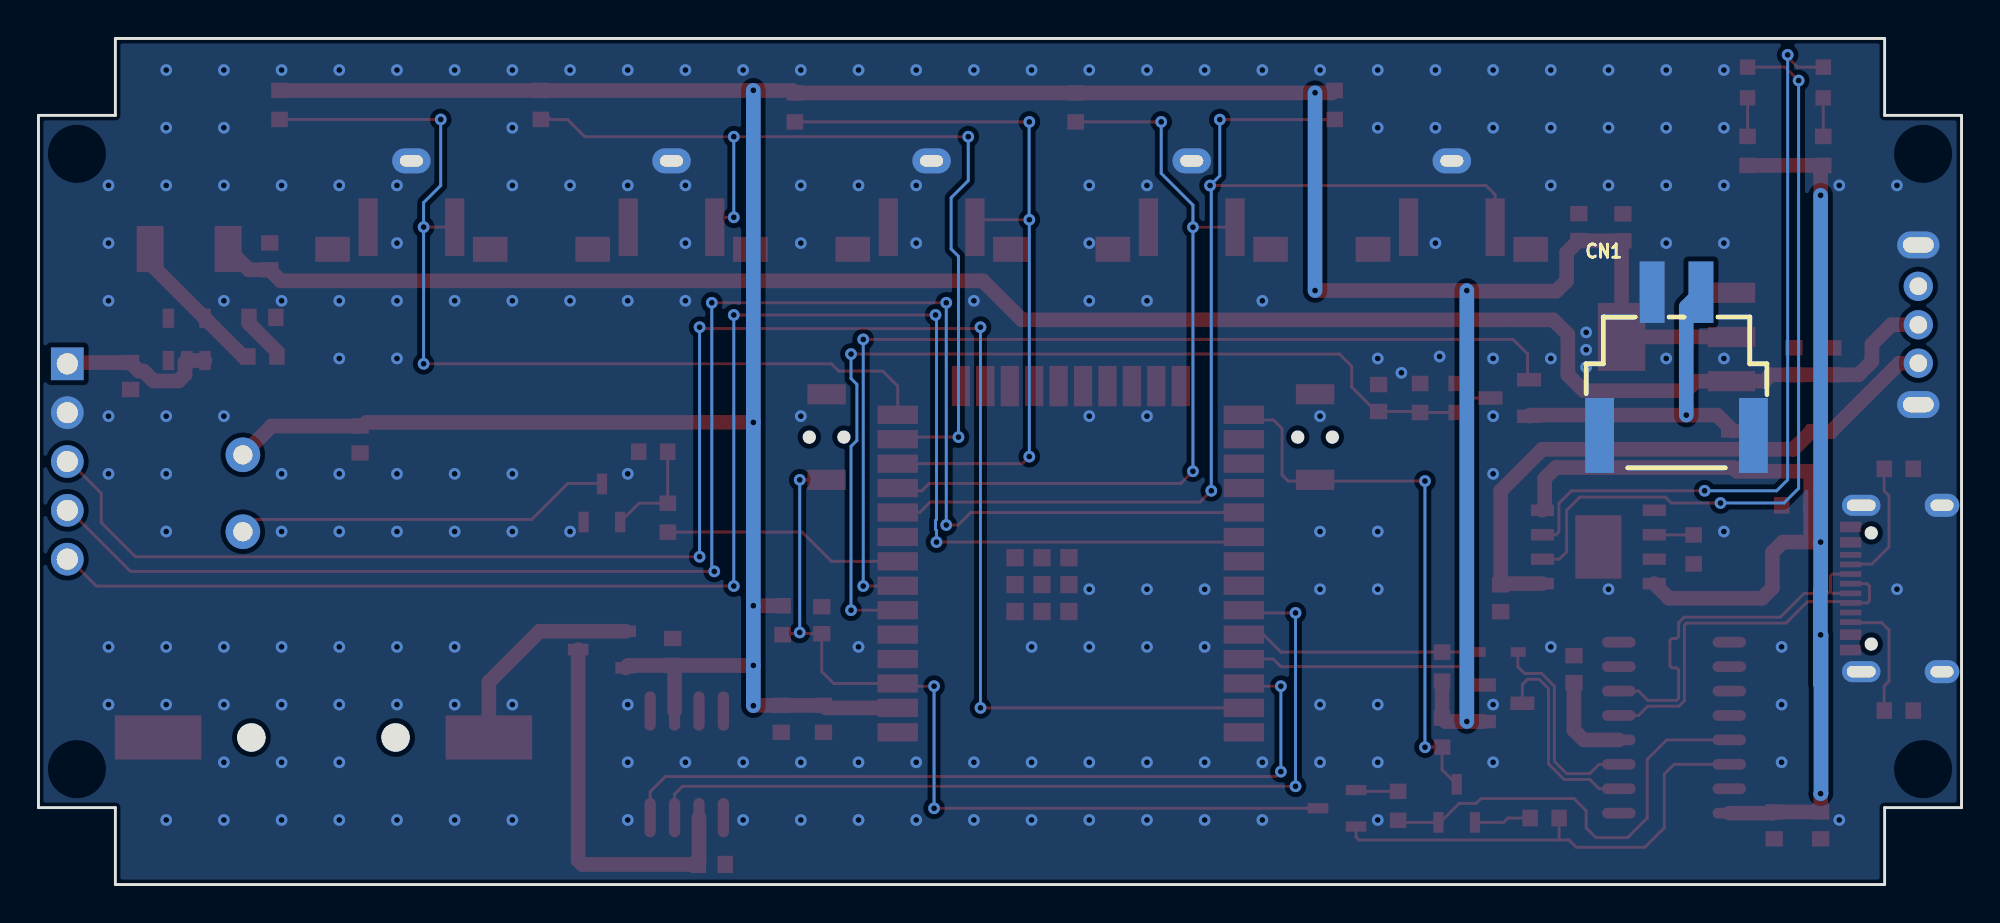
[diagram p2: board, bottom side, seen from below]

Outline 100 x 44 mm; copper layers: Top Layer, Bottom Layer. Coordinates in mm from the lower left corner of the outline.
Outline path: 0,40 4,40 4,44 96,44 96,40 100,40 100,4 96,4 96,0 4,0 4,4 0,4 0,40
Stack: Top Layer 0.035mm / Dielectric1 0.91mm FR4 er 4.5 / Bottom Layer 0.035mm

## Design rules (mm)
net VBAT: power
net GND: power
net 3V3: power
net VBUS: power
net CH_TXD: DP2
net CH_RXD: DP2
net USB_D+: DP1
net USB_D-: DP1
net $1N7195: power
net $1N7301: power
net VIN_1: power
net VIN_2: power
net $1N7868: power
net $1N9319: power
net $1N9320: power
net 5V: power
template: 自定义配置
spacing copperThickness1oz (default): track to track 0.178, other pairs 0.178 to 0.178
spacing copperThickness2oz: track to track 0.203, other pairs 0.152 to 0.3
track width copperThickness1oz (default): min 0.152, default 0.152, max 0.152
track width copperThickness2oz: min 0.203, default 0.203, max 0.203
track width power: min 0.508, default 0.762, max 5.08
differential pair differentialPair (default): width min 0.152, default 0.152, max 0.152; gap min 0.152, default 0.152
via viaSize (default): diameter min 0.61, default 0.61, max 0.61; hole min 0.305, default 0.305, max 0.305
net class power uses power
net VBAT uses power
net GND uses power
net 3V3 uses power
net VBUS uses power
net $1N7195 uses power
net $1N7301 uses power
net VIN_1 uses power
net VIN_2 uses power
net $1N7868 uses power
net $1N9319 uses power
net $1N9320 uses power
net 5V uses power

## Placement (name value [footprint] x y rotation side)
Boot  ZX-QC34-2TPDZ  [KEY-SMD_L3.9-W3.0-LS5.0-EH]  33.62 23.27 90 top
BUZZER1  2.7kHz  [BUZ-TH_BD9.0-P4.00-D0.6-FD]  89.37 20.35 270 top
C1  100nF  [C0603]  61.38 8.62 270 top
C2  10uF  [C0603]  7.33 3.08 270 top
C3  100nF  [C0603]  9.74 3.08 270 top
C4  10uF  [C0603]  59.18 8.62 270 top
C5  100nF  [C0603]  20.16 11.2 90 top
C6  100nF  [C0603]  59.27 13.75 270 top
C7  100nF  [C0603]  83.27 23.14 90 top
C8  10uF  [C0603]  23.97 14.89 270 top
C9  10uF  [C0603]  19.9 34.19 270 top
C10  100nF  [C0603]  17.61 34.18 270 top
C11  10uF  [C0603]  8.72 27.21 270 top
C12  100nF  [C0603]  6.69 27.21 270 top
C13  100nF  [C0603]  64.99 1.04 0 top
C14  100nF  [C0603]  67.02 12.09 90 top
C15  100nF  [C0603]  30.31 25.3 270 top
C16  22uF  [C0603]  95.21 26.44 90 top
C17  10uF  [C0603]  87.97 32.67 90 top
C18  4.7nF  [C0603]  88.35 29.49 0 top
CHRG_LED  NCD0603R1  [LED0603-RD_RED]  7.19 41.71 270 top
CN1  2.54-2A-WT  [CONN-SMD_2.54-2A-WT]  14.82 27.08 180 bottom
D1  B5819WS  [SOD-323_L1.7-W1.3-LS2.5-FD]  24.09 12.09 180 top
D2  BAT54C,215  [SOT-23-3_L2.9-W1.6-P1.90-LS2.8-BR]  70.7 12.22 180 top
D3  B5819WS  [SOD-323_L1.7-W1.3-LS2.5-FD]  7.84 22.51 90 top
H1  PZ254V-11-05P  [HDR-TH_5P-P2.54-V-M]  98.5 22 270 top
KEY1  TS-1045-A13B3-D2  [SW-SMD_L7.5-W8.0-P4.50_TS-1045-A13B3-D2]  26.5 35.33 180 top
KEY2  TS-1045-A13B3-D2  [SW-SMD_L7.5-W8.0-P4.50_TS-1045-A13B3-D2]  40.03 35.33 180 top
KEY3  TS-1045-A13B3-D2  [SW-SMD_L7.5-W8.0-P4.50_TS-1045-A13B3-D2]  53.56 35.33 180 top
KEY4  TS-1045-A13B3-D2  [SW-SMD_L7.5-W8.0-P4.50_TS-1045-A13B3-D2]  67.08 35.33 180 top
KEY5  TS-1045-A13B3-D2  [SW-SMD_L7.5-W8.0-P4.50_TS-1045-A13B3-D2]  80.61 35.33 180 top
L1  3.3uH  [IND-SMD_L4.4-W4.2-A]  92.16 33.05 0 top
Q1  S8050  [SOT-23-3_L2.9-W1.3-P1.90-LS2.3-BR]  26.25 4.22 270 top
Q2  S8050  [SOT-23-3_L2.9-W1.3-P1.90-LS2.3-BR]  32.47 3.97 180 top
Q3  2SK3018  [SOT-23-3_L2.9-W1.3-P1.90-LS2.4-BR]  23.84 9.43 0 top
Q4  S8050  [SOT-23-3_L2.9-W1.3-P1.90-LS2.3-BR]  70.7 19.84 270 top
Q5  SI2301CDS-T1-GE3-ES  [SOT-23-3_L2.9-W1.3-P1.90-LS2.4-BR]  23.49 25.3 180 top
Q6  SI2301CDS-T1-GE3-ES  [SOT-23-3_L2.9-W1.3-P1.90-LS2.4-BR]  10.88 22.64 0 top
R1  10kΩ  [R0603]  61.3 13.75 90 top
R2  5.1kΩ  [R0603]  3.26 9.05 180 top
R3  10kΩ  [R0603]  21.68 3.46 180 top
R4  5.1kΩ  [R0603]  3.26 21.62 180 top
R5  10kΩ  [R0603]  29.3 4.09 270 top
R6  10kΩ  [R0603]  27.01 7.9 90 top
R7  2kΩ  [R0603]  27.01 11.33 270 top
R8  2kΩ  [R0603]  7.19 38.15 270 top
R9  2kΩ  [R0603]  11.13 38.15 270 top
R10  1.2kΩ  [R0603]  13.93 17.43 90 top
R11  4.7kΩ  [R0603]  67.27 19.08 90 top
R12  3.3kΩ  [R0603]  68.03 22.51 180 top
R13  10kΩ  [R0603]  26.25 25.3 90 top
R14  10kΩ  [R0603]  8.6 19.71 180 top
R15  10kΩ  [R0603]  32.6 40.54 90 top
R16  10kΩ  [R0603]  46.06 40.42 90 top
R17  10kΩ  [R0603]  60.67 40.42 90 top
R18  10kΩ  [R0603]  73.88 40.54 90 top
R19  10kΩ  [R0603]  87.47 40.54 90 top
R20  10kΩ  [R0603]  28.16 25.3 270 top
R21  500mΩ  [R0603]  88.35 27.46 0 top
Reset  ZX-QC34-2TPDZ  [KEY-SMD_L3.9-W3.0-LS5.0-EH]  59.02 23.27 90 top
STDBY_LED  NCD0603C1  [LED0603-RD]  11.13 41.71 270 top
SW1  SK12D07VG4  [SW-TH_SK12D07VG4]  2.25 29.11 270 top
U1  CH340C  [SOP-16_L10.0-W3.9-P1.27-LS6.0-BL]  14.95 8.16 90 top
U2  ESP32-WROOM-32E-N4  [WIFI-SMD_ESP32-WROOM-32E]  46.32 16.92 90 top
U3  TP4056  [ESOP-8_L4.9-W3.9-P1.27-LS6.0-BL-EP]  18.89 17.56 270 top
U4  DS3231MZ+TRL  [SOIC-8_L4.9-W3.9-P1.27-LS6.0-BL]  66.29 6.25 180 top
U5  BL9110-330BPFB  [SOT-223_L6.5-W3.5-P2.30-LS7.0-BR]  14.82 28.48 180 top
U6  XDCR-1220-006  [BAT-SMD_CR1220-2ZX]  85.18 7.65 0 top
U7  PW5100  [SOT-23-5_L2.9-W1.6-P0.95-LS2.8-BL]  92.29 28.35 0 top
USB1  TYPE-C 16PIN 2MD(073)  [USB-C-SMD_TYPE-C-6PIN-2MD-073]  3.39 15.4 270 top

## Footprints (pads in the part's own frame, mm; a bottom-side part is the same pattern mirrored in y, then rotated)
BAT-SMD_CR1220-2ZX
  rect 4.5x2.3 smd: 1(-8.6,0) 2(8.6,0)
BUZ-TH_BD9.0-P4.00-D0.6-FD
  round 1.8 hole 1: 1(-2,0) 2(2,0)
C0603
  rect 0.8x0.9 smd: 1(-0.7,0) 2(0.7,0)
CONN-SMD_2.54-2A-WT
  rect 1.3x3.2 smd: 1(-1.27,3.725) 2(1.27,3.725)
  rect 1.5x3.9 smd: 3(-4,-3.725) 4(4,-3.725)
ESOP-8_L4.9-W3.9-P1.27-LS6.0-BL-EP
  rect 0.6x1.2 smd: 1(-1.905,-2.909) 2(-0.635,-2.909) 3(0.635,-2.909) 4(1.905,-2.909) 5(1.905,2.909) 6(0.635,2.909) 7(-0.635,2.909) 8(-1.905,2.909)
  rect 3.3x2.4 smd: 9(0,0)
HDR-TH_5P-P2.54-V-M
  rect 1.7x1.7 hole 1.1: 1(-5.08,0)
  round 1.7 hole 1.1: 2(-2.54,0) 3(0,0) 4(2.54,0) 5(5.08,0)
IND-SMD_L4.4-W4.2-A
  rect 1.4x2.4 smd: 1(2.028,0) 2(-2.028,0)
KEY-SMD_L3.9-W3.0-LS5.0-EH
  rect 1.05x2 smd: 1(-2.225,0) 2(2.225,0)
LED0603-RD
  rect 0.8x0.8 smd: 1(-0.799,0) 2(0.799,0)
LED0603-RD_RED
  rect 0.8x0.8 smd: 1(-0.799,-0.004) 2(0.799,0.004)
R0603
  rect 0.806x0.864 smd: 1(-0.753,0) 2(0.753,0)
SOD-323_L1.7-W1.3-LS2.5-FD
  rect 0.78x0.5 smd: 1(-1.04,0) 2(1.04,0)
SOIC-8_L4.9-W3.9-P1.27-LS6.0-BL
  oval 0.588x2.045 smd: 1(-1.905,-2.772) 2(-0.635,-2.772) 3(0.635,-2.772) 4(1.905,-2.772) 5(1.905,2.772) 6(0.635,2.772) 7(-0.635,2.772) 8(-1.905,2.772)
SOP-16_L10.0-W3.9-P1.27-LS6.0-BL
  oval 0.56x1.745 smd: 1(-4.445,-2.873) 2(-3.175,-2.873) 3(-1.905,-2.873) 4(-0.635,-2.873) 5(0.635,-2.873) 6(1.905,-2.873) 7(3.175,-2.873) 8(4.445,-2.873) 9(4.445,2.873) 10(3.175,2.873) 11(1.905,2.873) 12(0.635,2.873) 13(-0.635,2.873) 14(-1.905,2.873) 15(-3.175,2.873) 16(-4.445,2.873)
SOT-23-3_L2.9-W1.3-P1.90-LS2.3-BR
  rect 1.07x0.532 smd: 1(0.99,-0.95) 2(0.99,0.95) 3(-0.99,0)
SOT-23-3_L2.9-W1.3-P1.90-LS2.4-BR
  rect 1.25x0.7 smd: 1(1,-0.95) 2(1,0.95) 3(-1,0)
SOT-23-3_L2.9-W1.6-P1.90-LS2.8-BR
  rect 1.07x0.6 smd: 1(1.235,-0.95) 2(1.235,0.95) 3(-1.235,0)
SOT-23-5_L2.9-W1.6-P0.95-LS2.8-BL
  rect 0.6x1 smd: 1(-0.95,-1.1) 2(0,-1.1) 3(0.95,-1.1) 4(0.95,1.1) 5(-0.95,1.1)
SOT-223_L6.5-W3.5-P2.30-LS7.0-BR
  rect 2.465x1.05 smd: 1(2.857,-2.3) 2(2.857,0) 3(2.857,2.3)
  rect 2.465x3.54 smd: 4(-2.857,0)
SW-SMD_L7.5-W8.0-P4.50_TS-1045-A13B3-D2
  rect 1x3 smd: 1(-2.25,1.15) 2(2.25,1.15)
  rect 1.8x1.3 smd: 3(-4.1,2.3) 3(4.1,2.3)
  oval 2x1.3 hole 1.2x0.6: 3(0,-2.3)
SW-TH_SK12D07VG4
  round 1.524 hole 0.914: 1(-2,0) 2(0,0) 3(2,0)
  oval 1.4x2.2 hole 0.8x1.6: 4(4.15,0) 5(-4.15,0)
USB-C-SMD_TYPE-C-6PIN-2MD-073
  rect 0.55x1.1 smd: 1(-3.2,2.375) 2(-2.4,2.375) 11(2.4,2.375) 12(3.2,2.375)
  rect 0.3x1.1 smd: 3(-1.75,2.375) 4(-1.25,2.375) 5(-0.75,2.375) 6(-0.25,2.375) 7(0.25,2.375) 8(0.75,2.375) 9(1.25,2.375) 10(1.75,2.375)
  oval 1.1x2 hole 0.6x1.5: 13(-4.325,1.825) 14(4.325,1.825)
  oval 1.2x1.8 hole 0.6x1.2: 13(-4.325,-2.375) 14(4.325,-2.375)
WIFI-SMD_ESP32-WROOM-32E
  rect 0.95x2.1 smd: 1(-9.002,-9) 2(-7.732,-9) 3(-6.463,-9) 4(-5.192,-9) 5(-3.922,-9) 6(-2.652,-9) 7(-1.383,-9) 8(-0.113,-9) 9(1.157,-9) 10(2.428,-9) 11(3.697,-9) 12(4.968,-9) 13(6.237,-9) 14(7.508,-9) 25(7.508,9) 26(6.237,9) 27(4.968,9) 28(3.697,9) 29(2.428,9) 30(1.157,9) 31(-0.113,9) 32(-1.383,9) 33(-2.652,9) 34(-3.922,9) 35(-5.192,9) 36(-6.463,9) 37(-7.732,9) 38(-9.002,9)
  rect 2.1x0.95 smd: 15(9.002,-5.715) 16(9.002,-4.445) 17(9.002,-3.175) 18(9.002,-1.905) 19(9.002,-0.635) 20(9.002,0.635) 21(9.002,1.905) 22(9.002,3.175) 23(9.002,4.445) 24(9.002,5.715)
  rect 0.9x0.9 smd: 39(-2.721,-0.1) 39(-2.721,-1.5) 39(-2.721,-2.9) 39(-1.321,-0.1) 39(-1.321,-1.5) 39(-1.321,-2.9) 39(0.079,-0.1) 39(0.079,-1.5) 39(0.079,-2.9)

## Nets
As in the schematic.

Pads without a net: SW1 1; U1 7 8 9 10 11 12 15; U2 4 5 9 16 17 18 19 20 21 22 23 24 26 27 28 31 32; U4 1 3 4; U7 3; USB1 3 9

## Via types
v1: diameter 0.61, hole 0.305, Top Layer to Bottom Layer, 254 vias

## Routing (per net, layer and track width the routed paths; a pad name or vN(x,y) marks a point on that pad's centre or on a via; arc(x,y) is an arc through that point)
3V3: length 197.6
  Top Layer w0.762: C14.1 69.34,11.39 D2.2 ; C14.1 66.92,11.3 U4.2 ; C14.1 v1(62.83,11.39) ; R19.2 R18.2 60.79,41.3 R17.2 R16.2 32.73,41.17 R15.2 ; U5.2 U5.4 17.68,33.41 C10.2 19.9,33.48 ; BUZZER1.1 87.88,23.84 C7.2 ; R1.2 v1(62.83,14.5) ; 82.96,24.03 v1(62.83,24.03) ; C9.2 20.54,32.86 20.54,31.4 21.08,30.86 25.69,30.86 v1(25.72,30.89) v1(33.62,30.89) ; R7.2 R6.2 26.83,8.48 v1(25.72,8.48) Q3.1 ; v1(62.83,9.3) 62.81,9.32 C1.1 C4.1 59.05,9.19 U2.2
  Bottom Layer w0.762: v1(25.72,8.48) v1(25.72,30.89) ; v1(62.83,9.3) v1(62.83,11.39) v1(62.83,14.5) v1(62.83,24.03) v1(62.83,41.3) ; v1(33.62,30.89) v1(33.62,41.18)
5V: length 8.4
  Top Layer w0.762: 98.51,27.21 98.45,27.14 C16.2 94.77,26.7 94.53,26.7 94.02,26.19 92.71,26.19 92.38,26.52 92.38,27.16 U7.2 U7.1
GND:
  vias: v1(3.36,36.36) v1(3.36,15.36) v1(6.36,36.36) v1(6.36,3.36) v1(9.36,12.36) v1(9.36,9.36) v1(9.36,6.36) v1(12.36,42.36) v1(12.36,39.36) v1(12.36,36.36) v1(12.36,33.36) v1(12.36,27.36) v1(12.36,18.36) v1(15.36,42.36) v1(15.36,39.36) v1(15.36,36.36) v1(15.36,33.36) v1(15.36,27.36) v1(18.36,42.36) v1(18.36,39.36) v1(18.36,36.36) v1(18.36,15.36) v1(19.52,28.72) v1(19.52,27.81) v1(19.52,26.91) v1(21.36,42.36) v1(21.36,39.36) v1(21.36,36.36) v1(21.36,27.36) v1(21.36,12.36) v1(24.36,42.36) v1(24.36,39.36) v1(24.36,27.36) v1(24.36,24.36) v1(24.36,21.36) v1(24.36,9.36) v1(24.36,6.36) v1(27.14,27.46) v1(27.36,42.36) v1(27.36,39.36) v1(27.36,33.36) v1(29.13,26.61) v1(30.36,42.36) v1(30.36,39.36) v1(30.36,27.36) v1(30.36,18.36) v1(30.36,15.36) v1(30.36,9.36) v1(30.36,6.36) v1(30.36,3.36) v1(33.36,42.36) v1(33.36,24.36) v1(33.36,18.36) v1(33.36,15.36) v1(33.36,9.36) v1(33.36,6.36) v1(36.36,42.36) v1(36.36,30.36) v1(36.36,6.36) v1(36.36,3.36) v1(39.36,42.36) v1(39.36,15.36) v1(39.36,12.36) v1(39.36,6.36) v1(39.36,3.36) v1(42.36,42.36) v1(42.36,36.36) v1(42.36,30.36) v1(42.36,24.36) v1(42.36,15.36) v1(42.36,12.36) v1(42.36,6.36) v1(42.36,3.36) v1(45.36,42.36) v1(45.36,36.36) v1(45.36,33.36) v1(45.36,30.36) v1(45.36,24.36) v1(45.36,15.36) v1(45.36,12.36) v1(45.36,6.36) v1(45.36,3.36) v1(48.36,42.36) v1(48.36,12.36) v1(48.36,6.36) v1(48.36,3.36) v1(51.36,42.36) v1(51.36,30.36) v1(51.36,6.36) v1(51.36,3.36) v1(54.36,42.36) v1(54.36,36.36) v1(54.36,33.36) v1(54.36,6.36) v1(54.36,3.36) v1(57.36,42.36) v1(57.36,36.36) v1(57.36,12.36) v1(57.36,6.36) v1(57.36,3.36) v1(60.36,42.36) v1(60.36,36.36) v1(60.36,33.36) v1(60.36,24.36) v1(60.36,6.36) v1(60.36,3.36) v1(63.36,42.36) v1(63.36,6.36) v1(63.36,3.36) v1(66.36,42.36) v1(66.36,36.36) v1(66.36,33.36) v1(66.36,30.36) v1(66.36,6.36) v1(69.36,42.36) v1(69.36,36.36) v1(69.36,30.36) v1(69.36,21.36) v1(69.36,9.36) v1(69.36,6.36) v1(69.36,3.36) v1(72.36,42.36) v1(72.36,36.36) v1(72.36,30.36) v1(72.36,18.36) v1(75.36,42.36) v1(75.36,39.36) v1(75.36,36.36) v1(75.36,30.36) v1(75.36,21.36) v1(75.36,18.36) v1(75.36,9.36) v1(75.36,3.36) v1(78.36,42.36) v1(78.36,30.36) v1(78.36,21.36) v1(78.36,18.36) v1(78.36,12.36) v1(78.36,9.36) v1(78.36,3.36) v1(81.36,42.36) v1(81.36,36.36) v1(81.36,33.36) v1(81.36,30.36) v1(81.36,27.36) v1(81.36,21.36) v1(81.36,18.36) v1(81.36,12.36) v1(81.36,9.36) v1(81.36,3.36) v1(84.36,42.36) v1(84.36,36.36) v1(84.36,30.36) v1(84.36,27.36) v1(84.36,21.36) v1(84.36,18.36) v1(84.36,12.36) v1(84.36,9.36) v1(84.36,6.36) v1(84.36,3.36) v1(87.36,42.36) v1(87.36,36.36) v1(87.36,30.36) v1(87.36,21.36) v1(87.36,18.36) v1(87.36,12.36) v1(87.36,9.36) v1(87.36,6.36) v1(87.36,3.36) v1(90.36,42.36) v1(90.36,39.36) v1(90.36,36.36) v1(90.36,30.36) v1(90.36,24.36) v1(90.36,12.36) v1(90.36,9.36) v1(90.36,6.36) v1(90.36,3.36) v1(93.36,42.36) v1(93.36,39.36) v1(93.36,36.36) v1(93.36,24.36) v1(93.36,21.36) v1(93.36,18.36) v1(93.36,12.36) v1(93.36,9.36) v1(93.36,3.36) v1(96.36,36.36) v1(96.36,33.36) v1(96.36,30.36) v1(96.36,24.36) v1(96.36,21.36) v1(96.36,12.36) v1(96.36,9.36)
VBAT: length 17.7
  Top Layer w0.762: 11.88,23.58 12.71,24.41 v1(14.31,24.41) 22.43,24.41 Q5.2
  Bottom Layer w0.762: CN1.2 14.31,30.04 v1(14.31,24.41)
VBUS: length 75.6
  Top Layer w0.762: U1.16 9.81,3.71 C3.1 7.45,3.78 ; R9.2 R8.2 7.33,37.26 v1(7.33,35.84) ; D3.1 7.84,19.72 R14.2 7.84,18.33 v1(7.33,17.81) 9.3,17.81 9.84,17.27 9.84,15.43 10.38,14.89 15.21,14.89 U3.4 ; 8.09,21.49 11.69,21.49 Q6.1 21.11,21.69 21.68,21.11 21.68,19.57 U3.8 ; C2.1 v1(7.33,4.73)
  Bottom Layer w0.762: v1(7.33,4.73) 7.31,4.75 7.31,12.96 v1(7.33,12.98) ; v1(7.33,35.84) v1(7.33,17.81) 7.33,15.27 7.34,15.26 7.34,10.46 7.33,10.44
VIN_1: length 31.4
  Top Layer w0.762: U3.5 23.9,15.65 C8.1 23.97,20.48 22.57,21.87 ; 22.44,22 21.81,22.64 Q6.3 8.75,22.64 D3.2 6.8,23.55 3.23,27.11 SW1.3
VIN_2: length 93.9
  Top Layer w0.762: 23.71,29.37 48.86,29.37 50.89,31.4 87.4,31.4 C17.1 89.06,31.97 L1.2 ; SW1.2 3.64,29.11 4.66,28.1 4.66,27.21 5.36,26.51 9.93,26.51 10.26,26.18 U5.3 13.82,26.18 14.31,25.68 19.65,25.68 20.47,26.51 20.47,28.6 21.23,29.37 23.46,29.37
ADC: length 49.4
  Top Layer w0.152: R13.1 R20.2 28.21,24.6 C15.2 30.44,24.6 31.71,25.87 31.71,26.95 32.35,27.59 v1(57.75,27.59) ; U2.6 v1(57.75,14.27)
  Bottom Layer w0.152: v1(57.75,14.27) 57.75,22.79 57.44,23.09 57.44,26.01 57.75,26.32 v1(57.75,27.59)
ADC_EN: length 50.9
  Top Layer w0.152: U2.7 55.33,15.52 v1(57.11,15.52) ; Q5.1 22.57,26.33 22.57,27.6 23.32,28.35 v1(57.11,28.35)
  Bottom Layer w0.152: v1(57.11,28.35) v1(57.11,15.52)
BEEP: length 12.6
  Top Layer w0.152: U2.8 58.76,16.81 60.28,18.33 R11.1
BOOT: length 29.3
  Top Layer w0.152: U2.25 37.05,24.16 35.78,24.16 35.33,23.71 35.33,21.3 35.01,20.98 33.68,20.98 Boot.1 33.56,20.98 v1(27.9,20.98) ; v1(27.9,7.14) 27.89,7.15 R6.1 27.01,5.97 Q1.3
  Bottom Layer w0.152: v1(27.9,7.14) v1(27.9,20.98)
CH_RXD: length 10.8
  Top Layer w0.152: U1.2 18.85,4.98 19.33,5.46 20.66,5.46 21.48,6.28 21.48,10.19 21.96,10.67 22.57,10.67 22.84,10.4 Q3.3
CH_TXD: length 10.8
  Top Layer w0.152: D1.2 23.08,12.07 23.08,11.33 22.72,10.98 21.83,10.98 21.17,10.32 21.17,6.4 20.54,5.77 19.33,5.77 18.85,6.25 U1.3
DTR: length 23
  Top Layer w0.152: R5.2 29.19,3.23 27.11,3.23 26.12,4.22 25.23,4.22 24.98,4.47 20.16,4.47 19.52,3.84 19.52,2.95 19.01,2.44 17.36,2.44 16.34,3.46 16.34,6.51 15.33,7.52 U1.13
KEY1: length 59
  Top Layer w0.152: v1(38.57,39.78) 32.61,39.78 R15.1 ; v1(39.08,36.35) 24.73,36.35 24.25,35.88 KEY1.2 ; v1(39.01,20.48) 39.6,19.89 53.64,19.89 54.18,19.35 U2.10
  Bottom Layer w0.152: v1(39.01,20.48) 39.01,36.29 v1(39.08,36.35) 38.57,36.86 v1(38.57,39.78)
KEY2: length 41.3
  Top Layer w0.152: R16.1 v1(41.62,39.66) ; KEY2.2 v1(39.97,34.19) ; U2.11 55.18,20.48 54.06,20.48 53.68,20.86 40.6,20.86 v1(39.97,21.49)
  Bottom Layer w0.152: v1(41.62,39.66) 41.62,36.99 39.97,35.33 v1(39.97,34.19) v1(39.97,21.49)
KEY3: length 39.6
  Top Layer w0.152: v1(48.48,22.25) 48.84,21.89 U2.12 ; KEY3.2 50.92,34.57 v1(48.48,34.57) ; R17.1 v1(48.48,39.66)
  Bottom Layer w0.152: v1(48.48,39.66) 48.49,39.65 48.49,34.58 v1(48.48,34.57) v1(48.48,22.25)
KEY4: length 47
  Top Layer w0.152: U2.13 55.2,23.27 v1(52.16,23.27) ; v1(63.84,34.7) 64.32,34.7 KEY4.2 ; v1(51.65,38.89) v1(63.84,38.89) 71.59,38.89 72.48,39.78 73.37,39.78 73.5,39.91
  Bottom Layer w0.152: v1(51.65,38.89) 51.65,36.61 52.54,35.72 52.54,33.05 52.16,32.67 v1(52.16,23.27) ; v1(63.84,34.7) v1(63.84,38.89)
KEY5: length 49.8
  Top Layer w0.152: U2.14 55.32,25.92 56.1,26.7 58.38,26.7 58.76,27.08 v1(79.97,27.08) ; R19.1 v1(79.08,39.79) ; v1(79.97,34.19) 78.36,34.19 KEY5.2
  Bottom Layer w0.152: 79.84,34.19 79.97,34.06 v1(79.97,27.08) ; v1(79.08,39.79) 79.08,36.35 79.97,35.46 v1(79.97,34.19)
LOAD: length 88.5
  Top Layer w0.152: v1(64.86,16.28) 95.21,16.28 98.51,19.59 ; v1(52.79,30.25) v1(64.99,30.25) ; v1(52.79,18.7) 52.17,18.7 51.52,19.35 U2.29
  Bottom Layer w0.152: v1(52.79,18.7) v1(52.79,30.25) ; v1(64.99,30.25) 64.99,16.41 v1(64.86,16.28)
MOSI: length 96
  Top Layer w0.152: v1(51.02,28.98) 51.09,28.91 65.54,28.91 v1(65.62,28.98) ; 98.51,22.13 96.74,20.35 96.74,18.83 94.96,17.05 v1(65.62,17.05) ; U2.37 v1(51.02,9.19)
  Bottom Layer w0.152: v1(51.02,9.19) v1(51.02,28.98) ; v1(65.62,28.98) v1(65.62,17.05)
RESET: length 45.8
  Top Layer w0.152: R1.1 61.25,13.05 C6.2 59.27,11.08 58.65,10.46 U2.3 55.18,10.32 v1(53.43,10.32) ; Q2.3 v1(53.43,3.97) ; Reset.1 v1(60.41,21.05)
  Bottom Layer w0.152: v1(53.43,3.97) v1(53.43,10.32) ; v1(60.41,21.05) v1(60.41,13.11)
RTS: length 24.7
  Top Layer w0.152: 20.93,2.31 R3.2 ; 20.93,2.31 20.41,2.31 20.03,1.93 16.47,1.93 15.46,2.95 15.46,5.74 14.95,6.25 U1.14 ; 20.93,2.31 31.33,2.31 31.48,2.47 Q2.2
RXD: length 12.6
  Top Layer w0.152: U2.34 36.3,13 35.39,12.09 R7.1 27,12.09 D1.1
SCL: length 41
  Top Layer w0.152: U2.36 37.18,10.32 v1(35.4,10.32) ; v1(35.4,5.87) 35.65,5.62 67.4,5.62 68.19,4.82 U4.8
  Bottom Layer w0.152: v1(35.4,5.87) v1(35.4,10.32)
SCLK: length 87.9
  Top Layer w0.152: v1(53.3,17.81) 37.59,17.81 U2.30 ; v1(63.84,15.52) 96.99,15.52 98.51,17.05 ; v1(63.84,29.62) v1(53.35,29.62)
  Bottom Layer w0.152: v1(53.35,29.62) 53.3,29.57 53.3,18.98 53.35,18.93 53.35,18.47 53.3,18.42 v1(53.3,17.81) ; v1(63.84,29.62) v1(63.84,15.52)
SDA: length 45.4
  Top Layer w0.152: v1(34.63,14.13) 37.18,14.13 U2.33 ; v1(34.63,5.11) 66.51,5.11 66.92,4.7 U4.7
  Bottom Layer w0.152: v1(34.63,5.11) v1(34.63,14.13)
TXD: length 13
  Top Layer w0.152: U2.35 35.79,11.73 35.4,11.33 26,11.33 25.04,10.38 24.84,10.38
USB_D+: length 19.7
  Top Layer w0.152: USB1.6 4.91,15.65 4.79,15.52 4.79,14.76 4.9,14.65 USB1.8 5.83,14.71 8.01,14.71 9.12,13.6 14.3,13.6 14.41,13.49 14.41,9.56 14.69,9.27 16.31,9.27 16.8,8.79 U1.5
USB_D-: length 19.5
  Top Layer w0.152: USB1.5 6.7,16.15 6.82,16.03 6.82,15.26 ; 6.82,15.26 6.97,15.14 8.19,15.14 9.42,13.9 14.43,13.9 14.71,13.62 14.71,12.9 14.82,12.8 15.06,12.8 15.17,12.69 15.17,11.38 15.06,11.27 14.82,11.27 14.71,11.16 14.71,9.69 14.82,9.58 16.31,9.58 16.8,10.06 U1.6 ; 6.82,15.26 6.71,15.14 6.5,15.15 USB1.7
$1N1245: length 2.2
  Top Layer w0.152: R5.1 31.41,4.85 Q2.1
$1N2308: length 2
  Top Layer w0.152: U3.2 15.97,18.18 R10.2
$1N2312: length 2
  Top Layer w0.152: CHRG_LED.2 7.19,40.91 R8.1
$1N2313: length 2
  Top Layer w0.152: R9.1 STDBY_LED.2
$1N2314: length 39.1
  Top Layer w0.152: CHRG_LED.1 8.53,42.51 9.04,43.02 v1(9.04,43.15) ; U3.7 21.09,18.19 20.94,18.34 20.94,19.82 20.28,20.48 v1(13.36,20.48)
  Bottom Layer w0.152: v1(13.36,20.48) 9.61,20.48 9.04,21.05 v1(9.04,43.15)
$1N2315: length 40.5
  Top Layer w0.152: U3.6 20.92,16.92 20.54,17.3 20.54,19.46 19.85,20.15 15.4,20.15 15.1,19.84 v1(12.53,19.84) ; v1(8.47,41.81) 9.17,42.51 STDBY_LED.1
  Bottom Layer w0.152: v1(12.53,19.84) 9.23,19.84 8.47,20.6 v1(8.47,41.81)
$1N7195: length 19.7
  Top Layer w0.762: D2.3 71.94,1.26 71.72,1.04 C13.2 65.65,1.08 65.65,3.48
$1N7301: length 11.1
  Top Layer w0.762: D2.1 73.94,13.17 76.58,10.53 U6.1
$1N7868: length 5
  Top Layer w0.762: U1.4 19.65,7.52 20.16,8.03 C5.1
$1N8103: length 6.5
  Top Layer w0.152: USB1.4 5.75,16.67 4.66,16.67 3.77,17.56 3.77,20.22 4.03,20.48 4.03,21.61 R4.1
$1N8104: length 6.5
  Top Layer w0.152: USB1.10 5.74,13.62 4.15,13.62 3.77,13.24 3.77,10.57 4.03,10.32 4.03,9.05 R2.1
$1N8623: length 2.1
  Top Layer w0.152: R13.2 25.5,25.3 Q5.3
$1N8862: length 19.8
  Top Layer w0.152: 89.75,18.98 74.35,18.98 72.48,20.86 70.73,20.86 70.7,20.83
$1N8910: length 5.6
  Top Layer w0.152: R12.2 67.28,19.84 R11.2 68.77,19.83 Q4.1
$1N9319: length 2.6
  Top Layer w0.762: C18.2 89.05,29.18 87.6,27.72 R21.1
$1N9320: length 7.8
  Top Layer w0.762: R21.2 89.35,27.46 U7.5 94.19,32.3 L1.1
$1N16703: length 3
  Top Layer w0.152: Q1.1 23.81,3.23 23.58,3.46 R3.1

## Copper pours and planes (outline as drawn; the poured copper is in the pictures)
GND on Top Layer: 0,40 3.86,40 3.9,40.03 3.9,44.19 96,44.19 96,40.14 96.1,40.03 99.91,40.03 100.04,39.91 100.04,4 96.13,4 96.1,3.97 96.1,0 4.06,0 4.03,0.03 4.03,4 0,4
GND on Bottom Layer: 0,40 3.86,40 3.9,40.03 3.9,44.24 95.97,44.24 96.1,44.11 96.1,40.03 100,40.03 100,4 96.13,4 96.1,3.97 96.1,0 4,0 4,4 0,4
VBUS on Top Layer: 7.73,13.3 7.73,12.65 6.18,12.65 6.18,13.3

Small or netless copper shapes (teardrops, artwork), in the pictures only: 1 on Top Layer
